# EAGLE design Green Pill Sparkfun (EAGLE 9.3.1)
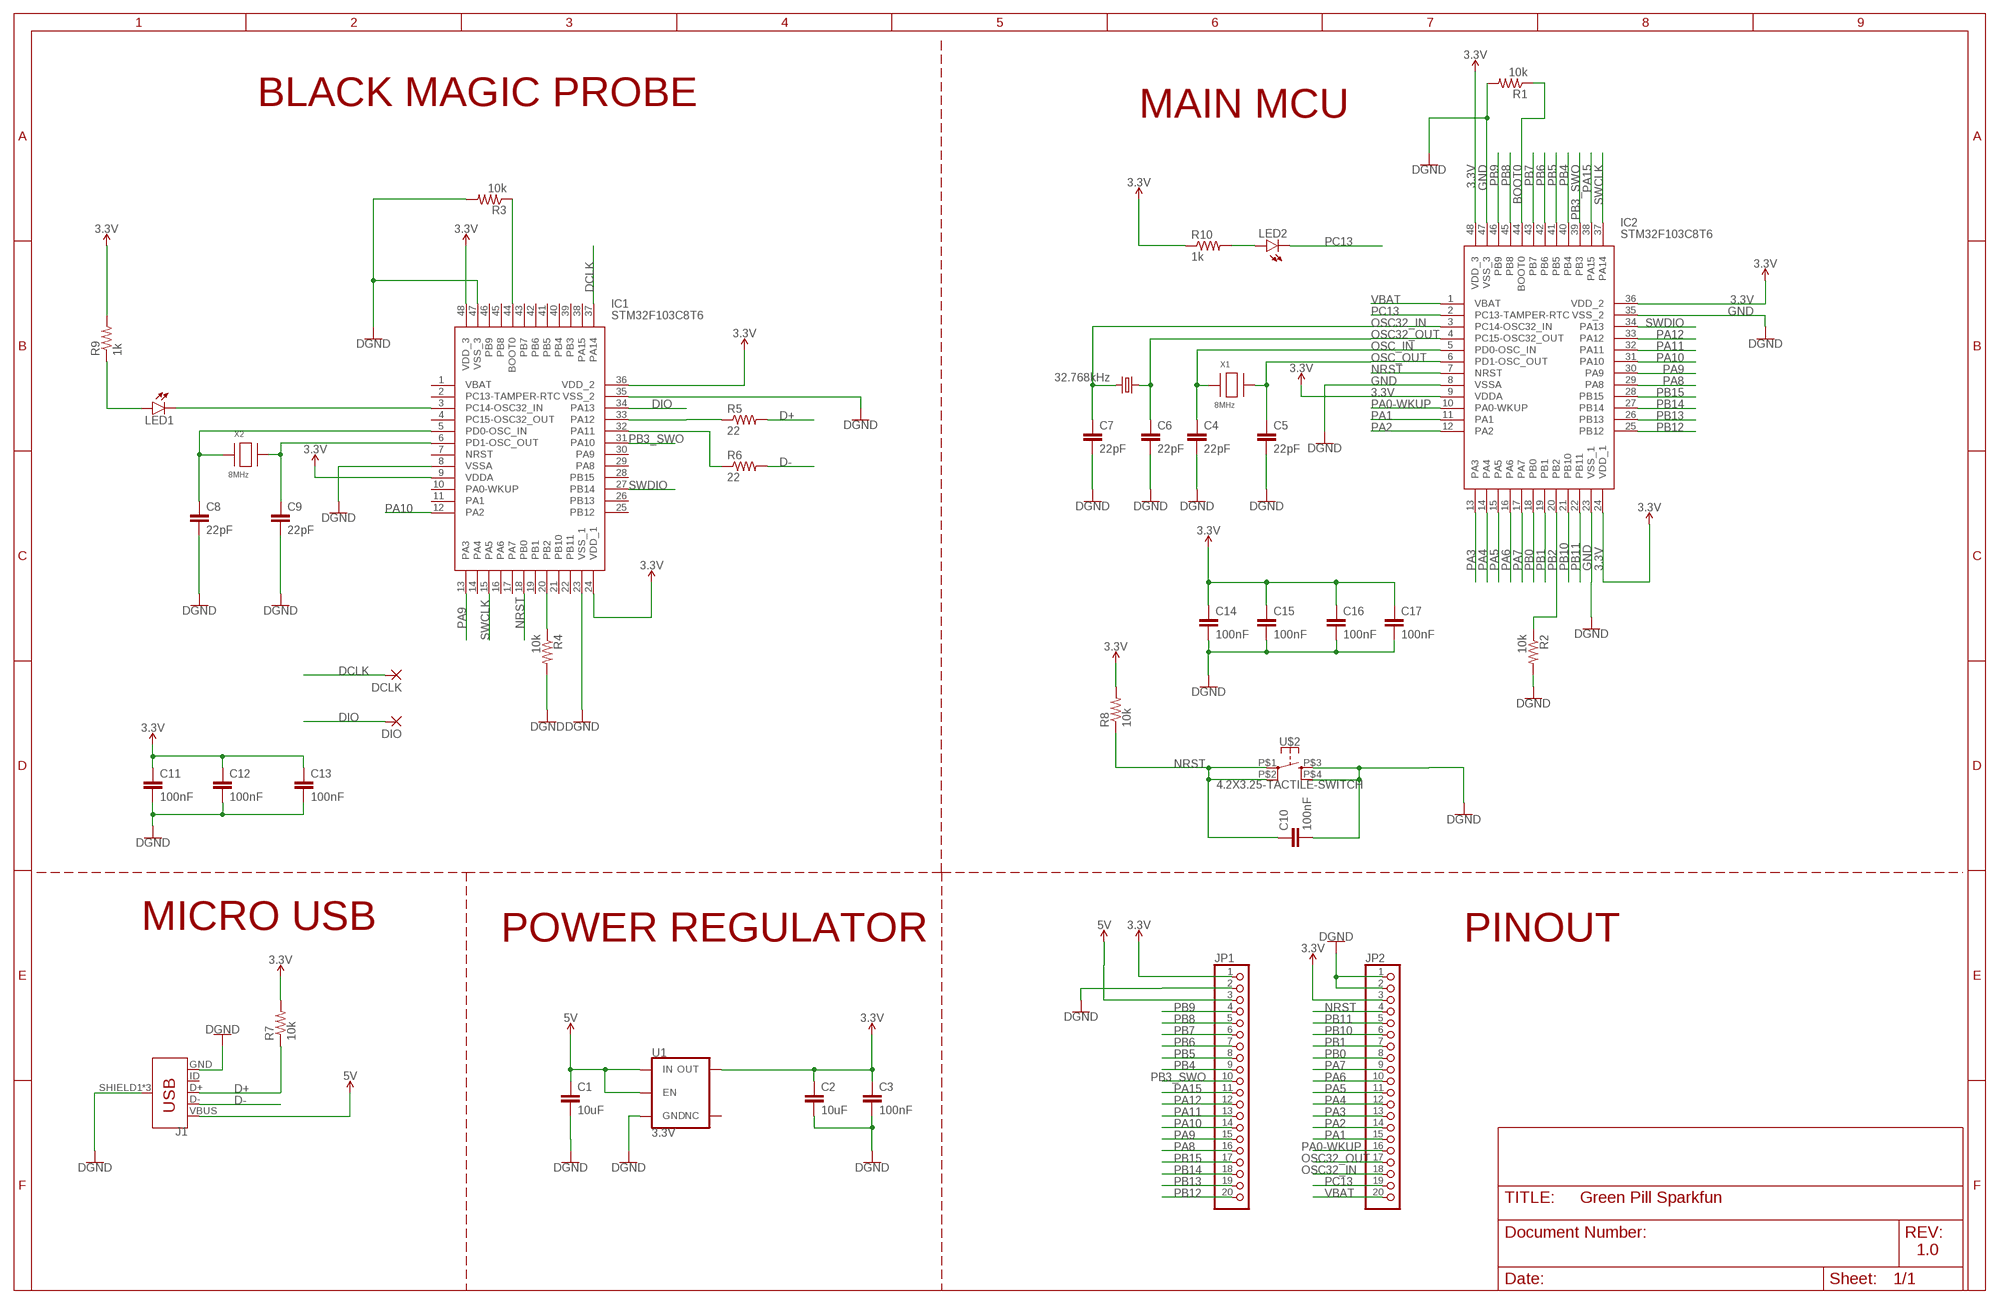
[diagram p0: schematic, sheet 1]

## Parts
C1  10uF  C-EUC0805  [C0805]
C2  10uF  C-EUC0805  [C0805]
C3  100nF  C-EUC0603  [C0603]
C4  22pF  C-EUC0603  [C0603]
C5  22pF  C-EUC0603  [C0603]
C6  22pF  C-EUC0603  [C0603]
C7  22pF  C-EUC0603  [C0603]
C8  22pF  C-EUC0603  [C0603]
C9  22pF  C-EUC0603  [C0603]
C10  100nF  C-EUC0603  [C0603]
C11  100nF  C-EUC0603  [C0603]
C12  100nF  C-EUC0603  [C0603]
C13  100nF  C-EUC0603  [C0603]
C14  100nF  C-EUC0603  [C0603]
C15  100nF  C-EUC0603  [C0603]
C16  100nF  C-EUC0603  [C0603]
C17  100nF  C-EUC0603  [C0603]
DCLK  SMD2  [SMD1,27-2,54]
DIO  SMD2  [SMD1,27-2,54]
IC1  STM32F103C8T6  [QFP50P900X900X160-48N]
IC2  STM32F103C8T6  [QFP50P900X900X160-48N]
J1  USB_MICRO-B_FEMALE-SMT  [USB-B-MICRO-SMD]
JP1  PINHD-1X20  [1X20]
JP2  PINHD-1X20  [1X20]
LED1  LEDCHIP-LED0805  [CHIP-LED0805]
LED2  LEDCHIP-LED0805  [CHIP-LED0805]
R1  10k  R-US_R0603  [R0603]
R2  10k  R-US_R0603  [R0603]
R3  10k  R-US_R0603  [R0603]
R4  10k  R-US_R0603  [R0603]
R5  22  R-US_R0603  [R0603]
R6  22  R-US_R0603  [R0603]
R7  10k  R-US_R0603  [R0603]
R8  10k  R-US_R0603  [R0603]
R9  1k  R-US_R0603  [R0603]
R10  1k  R-US_R0603  [R0603]
U1  3.3V  V_REG_AP2112K-3.3V  [SOT23-5]
U$1  32.768kHz  KX-327  [3.2X1.5]
U$2  4.2X3.25-TACTILE-SWITCH  [4.2X3.25]
X1  8MHz  XTALNX5032  [NX5032]
X2  8MHz  XTALNX5032  [NX5032]

## Nets
3.3V: C2.1 C3.1 C11.1 C12.1 C13.1 C14.1 C15.1 C16.1 C17.1 IC1.9(VDDA) IC1.24(VDD_1) IC1.36(VDD_2) IC1.48(VDD_3) IC2.9(VDDA) IC2.24(VDD_1) IC2.36(VDD_2) IC2.48(VDD_3) JP1.1 JP2.3 R7.2 R8.2 R9.2 R10.1 U1.5(OUT)
5V: C1.1 J1.VBUS JP1.3 U1.1(IN) U1.3(EN)
BOOT0: IC2.44(BOOT0) R1.1
D+: J1.D+ R5.2 R7.1
D-: J1.D- R6.2
DCLK: DCLK.1(P) IC1.37(PA14)
DIO: DIO.1(P) IC1.34(PA13)
GND: C1.2 C2.2 C3.2 C4.2 C5.2 C6.2 C7.2 C8.2 C9.2 C10.2 C11.2 C12.2 C13.2 C14.2 C15.2 C16.2 C17.2 IC1.8(VSSA) IC1.23(VSS_1) IC1.35(VSS_2) IC1.47(VSS_3) IC2.8(VSSA) IC2.23(VSS_1) IC2.35(VSS_2) IC2.47(VSS_3) J1.GND J1.SHIELD1(SHIELD) J1.SHIELD2(SHIELD) J1.SHIELD3(SHIELD) JP1.2 JP2.1 JP2.2 R1.2 R2.2 R3.2 R4.2 U1.2(GND) U$2.P$3 U$2.P$4 ; supply symbol labelled DGND
N$1: IC1.33(PA12) R5.1
N$2: IC1.32(PA11) R6.1
N$3: IC1.44(BOOT0) R3.1
N$4: C8.1 IC1.5(PD0-OSC_IN) X2.P$1
N$5: IC1.20(PB2) R4.1
N$6: C9.1 IC1.6(PD1-OSC_OUT) X2.P$2
N$7: IC1.3(PC14-OSC32_IN) LED1.C
N$8: LED1.A R9.1
N$9: LED2.A R10.2
NRST: C10.1 IC1.18(PB0) IC2.7(NRST) JP2.4 R8.1 U$2.P$1 U$2.P$2
OSC32_IN: C7.1 IC2.3(PC14-OSC32_IN) JP2.18 U$1.2
OSC32_OUT: C6.1 IC2.4(PC15-OSC32_OUT) JP2.17 U$1.1
OSC_IN: C4.1 IC2.5(PD0-OSC_IN) X1.P$1
OSC_OUT: C5.1 IC2.6(PD1-OSC_OUT) X1.P$2
PA0-WKUP: IC2.10(PA0-WKUP) JP2.16
PA1: IC2.11(PA1) JP2.15
PA2: IC2.12(PA2) JP2.14
PA3: IC2.13(PA3) JP2.13
PA4: IC2.14(PA4) JP2.12
PA5: IC2.15(PA5) JP2.11
PA6: IC2.16(PA6) JP2.10
PA7: IC2.17(PA7) JP2.9
PA8: IC2.29(PA8) JP1.16
PA9: IC1.13(PA3) IC2.30(PA9) JP1.15
PA10: IC1.12(PA2) IC2.31(PA10) JP1.14
PA11: IC2.32(PA11) JP1.13
PA12: IC2.33(PA12) JP1.12
PA15: IC2.38(PA15) JP1.11
PB0: IC2.18(PB0) JP2.8
PB1: IC2.19(PB1) JP2.7
PB2: IC2.20(PB2) R2.1
PB3_SWO: IC1.31(PA10) IC2.39(PB3) JP1.10
PB4: IC2.40(PB4) JP1.9
PB5: IC2.41(PB5) JP1.8
PB6: IC2.42(PB6) JP1.7
PB7: IC2.43(PB7) JP1.6
PB8: IC2.45(PB8) JP1.5
PB9: IC2.46(PB9) JP1.4
PB10: IC2.21(PB10) JP2.6
PB11: IC2.22(PB11) JP2.5
PB12: IC2.25(PB12) JP1.20
PB13: IC2.26(PB13) JP1.19
PB14: IC2.27(PB14) JP1.18
PB15: IC2.28(PB15) JP1.17
PC13: IC2.2(PC13-TAMPER-RTC) JP2.19 LED2.C
SWCLK: IC1.15(PA5) IC2.37(PA14)
SWDIO: IC1.27(PB14) IC2.34(PA13)
VBAT: IC2.1(VBAT) JP2.20
Unconnected: IC1.1(VBAT) IC1.2(PC13-TAMPER-RTC) IC1.4(PC15-OSC32_OUT) IC1.7(NRST) IC1.10(PA0-WKUP) IC1.11(PA1) IC1.14(PA4) IC1.16(PA6) IC1.17(PA7) IC1.19(PB1) IC1.21(PB10) IC1.22(PB11) IC1.25(PB12) IC1.26(PB13) IC1.28(PB15) IC1.29(PA8) IC1.30(PA9) IC1.38(PA15) IC1.39(PB3) IC1.40(PB4) IC1.41(PB5) IC1.42(PB6) IC1.43(PB7) IC1.45(PB8) IC1.46(PB9) J1.ID U1.4(NC)

## Notes on the sheet
- BLACK MAGIC PROBE | MAIN MCU
- MICRO USB | POWER REGULATOR | PINOUT
- 1.0

## Library data of the parts
C1-C3 C10-C17 = rcl:C-EU: CAPACITOR, European symbol; SPICEPREFIX: C
C4-C9 = resistor:C-EU: CAPACITOR, European symbol
DCLK DIO = wirepad:SMD2: SMD PAD
IC1 IC2 = LCSC:STM32F103C8T6: STM32F103C8T6, 32 bit ARM Cortex M3 Microcontroller 72MHz 64kb Flash, 20kb RAM, USB I2C SPI 48-Pin LQFP Source: Datasheet <http://www.mouser.com/datasheet/2/389/stm32f103c8-956229.pdf>; DESCRIPTION: STM32F103C8T6, 32 bit ARM Cortex M3 Microcontroller 72MHz 64kb Flash, 20kb RAM, USB I2C SPI 48-Pin LQFP; HEIGHT: 1.6mm; MANUFACTURER_NAME: STMicroelectronics; MANUFACTURER_PART_NUMBER: STM32F103C8T6; MOUSER_PART_NUMBER: 511-STM32F103C8T6
J1 = SparkFun-Connectors:USB_MICRO-B: USB Type Micro-B Connector Male/female and PTH/SMT variants SparkFun Products: SparkFun microB USB Breakout <https://www.sparkfun.com/products/12035> SparkFun USB microB Plug Breakout <https://www.sparkfun.com/products/10031> SparkFun ESP8266 Thing <https://www.sparkfun.com/products/13231>; PROD_ID: CONN-11752
JP1 JP2 = pinhead:PINHD-1X20: PIN HEADER
LED1 LED2 = led:LED: LED OSRAM: - CHIPLED LG R971, LG N971, LY N971, LG Q971, LY Q971, LO R971, LY R971 LH N974, LH R974 LS Q976, LO Q976, LY Q976 LO Q996 - Hyper CHIPLED LW Q18S LB Q993, LB Q99A, LB R99A - SideLED LS A670, LO A670, LY A670, LG A670, LP A670 LB A673, LV A673, LT A673, LW A673 LH A674 LY A675 LS A676, LA A676, LO A676, LY A676, LW A676 LS A679, LY A679, LG A679 - Hyper Micro SIDELED® LS Y876, LA Y876, LO Y876, LY Y876 LT Y87S - SmartLED LW L88C, LW L88S LB L89C, LB L89S, LG L890 LS L89K, LO L89K, LY L89K LS L896, LA L896, LO L896, LY L896 - TOPLED LS T670, LO T670, LY T670, LG T670, LP T670 LSG T670, LSP T670, LSY T670, LOP T670, LYG T670 LG T671, LOG T671, LSG T671 LB T673, LV T673, LT T673, LW T673 LH T674 LS T676, LA T676, LO T676, LY T676, LB T676, LH T676, LSB T676, LW T676 LB T67C, LV T67C, LT T67C, LS T67K, LO T67K, LY T67K, LW E67C LS E67B, LA E67B, LO E67B, LY E67B, LB E67C, LV E67C, LT E67C LW T67C LS T679, LY T679, LG T679 LS T770, LO T770, LY T770, LG T770, LP T770 LB T773, LV T773, LT T773, LW T773 LH T774 LS E675, LA E675, LY E675, LS T675 LS T776, LA T776, LO T776, LY T776, LB T776 LHGB T686 LT T68C, LB T68C - Hyper Mini TOPLED® LB M676 - Mini TOPLED Santana® LG M470 LS M47K, LO M47K, LY M47K Source: http://www.osram.convergy.de LUXEON: - LUMILED® LXK2-PW12-R00, LXK2-PW12-S00, LXK2-PW14-U00, LXK2-PW14-V00 LXK2-PM12-R00, LXK2-PM12-S00, LXK2-PM14-U00 LXK2-PE12-Q00, LXK2-PE12-R00, LXK2-PE12-S00, LXK2-PE14-T00, LXK2-PE14-U00 LXK2-PB12-K00, LXK2-PB12-L00, LXK2-PB12-M00, LXK2-PB14-N00, LXK2-PB14-P00, LXK2-PB14-Q00 LXK2-PR12-L00, LXK2-PR12-M00, LXK2-PR14-Q00, LXK2-PR14-R00 LXK2-PD12-Q00, LXK2-PD12-R00, LXK2-PD12-S00 LXK2-PH12-R00, LXK2-PH12-S00 LXK2-PL12-P00, LXK2-PL12-Q00, LXK2-PL12-R00 Source: www.luxeon.com KINGBRIGHT: KA-3528ASYC Source: www.kingbright.com
R1-R4 R8-R10 = rcl:R-US_: RESISTOR, American symbol; SPICEPREFIX: R
R5-R7 = resistor:R-US_: RESISTOR, American symbol
U1 = SparkFun-IC-Power:V_REG_AP2112: AP2112 - 600mA CMOS LDO Regulator w/ Enable The AP2112 is CMOS process low dropout linear regulator with enable function, the regulator delivers a guaranteed 600mA (min.) continuous load current. Features Output Voltage Accuracy: ±1.5% Output Current: 600mA (Min.) Foldback Short Current Protection: 50mA Enable Function to Turn ON/OFF VOUT Low Dropout Voltage (3.3V): 250mV (Typ.) @IOUT=600mA Excellent Load Regulation: 0.2%/A (Typ.) Excellent Line Regulation: 0.02%/V (Typ.) Low Quiescent Current: 55μA (Typ.) Low Standby Current: 0.01μA (Typ.) Low Output Noise: 50μVRMS PSRR: 100Hz -65dB, 1kHz -65dB OTSD Protection Stable with 1.0μF Flexible Cap: Ceramic, Tantalum and Aluminum Electrolytic Operation Temperature Range: -40°C to 85°C ESD: MM 400V, HBM 4000V; PROD_ID: VREG-12457
U$1 = SPEAR:KX-327
U$2 = LCSC:4.2X3.25-TACTILE-SWITCH
X1 X2 = adafruit:XTAL: Low cost SMT crystals, no capacitors included http://www.ladyada.net/library/eagle

## Board
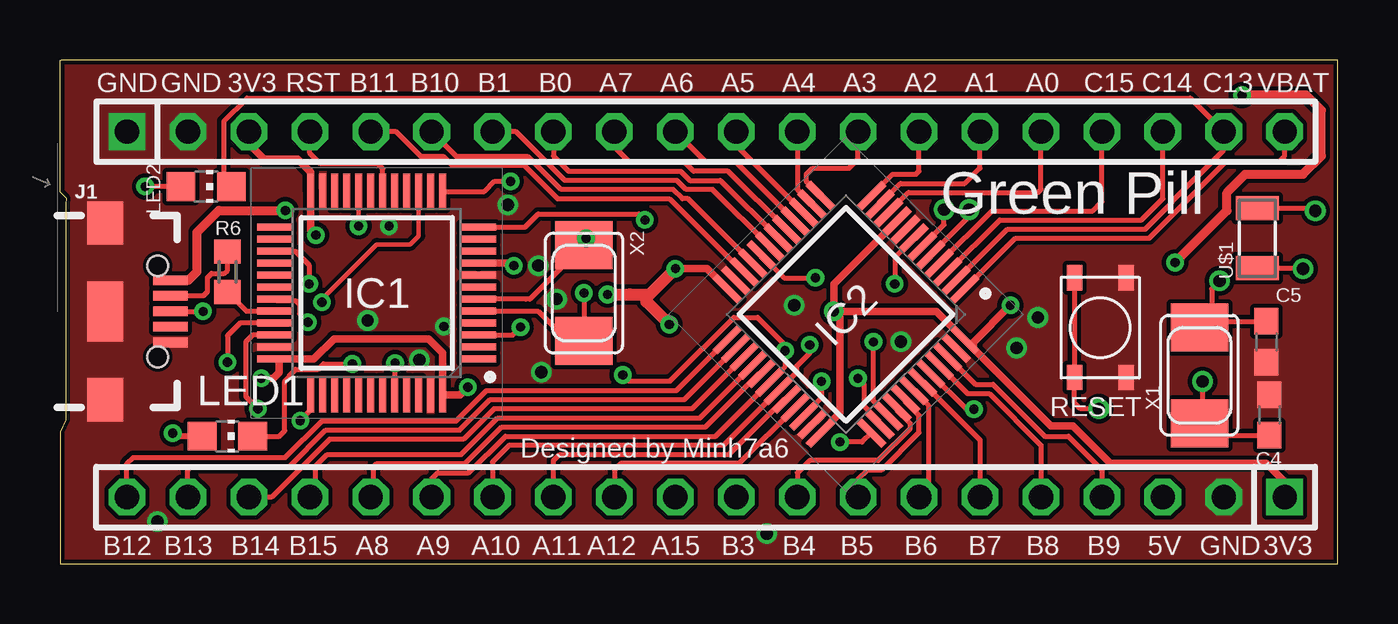
[diagram p1: board, top side]
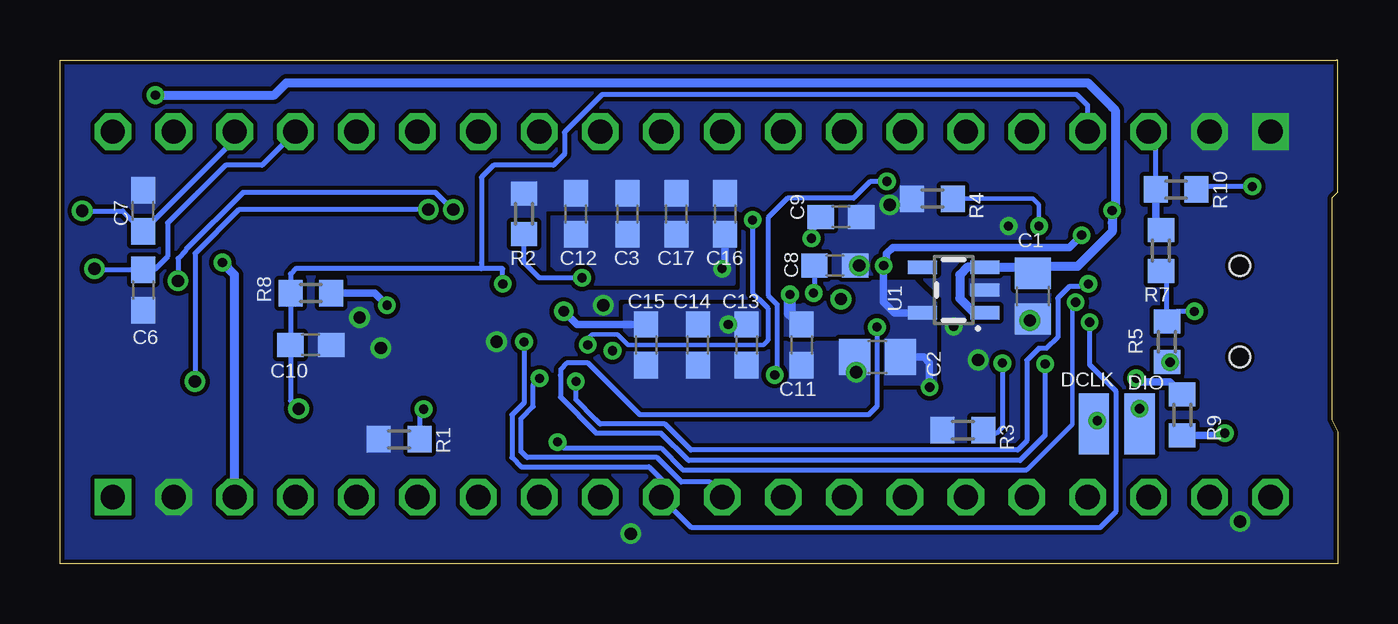
[diagram p2: board, bottom side, seen from below]

Size 53.25 x 21 mm. Coordinates in mm from the lower left corner, seen from the top.
Outline: 0.05,0 53.25,0 53.25,21 0.05,21 0,21 0,15.5 0.25,15.25 0.25,15 0.25,6 0,5.5 0,0 0.05,0
Copper layers (1*16): Top 0.035mm / dielectric 1.5mm / Bottom 0.035mm
Design rules "SparkFun-2-layer-TIGHT": minimum track width 7mil, minimum drill 15mil, track to track 7mil, track to pad 7mil, pad to pad 7mil, via to via 7mil, smd to smd 7mil, copper to edge 7mil, drill to drill 7mil, minimum pad ring 7mil, minimum via ring 7mil, stop-mask expansion 4mil, vias tented up to drill 25mil, thermal gap 10mil

### Footprints (pad centres in the part's own frame; a part is rotated, then mirrored left to right if it is on the bottom)
C0805 = smd 1.3 x 1.5: 1 -0.95,0; 2 0.95,0
C0603 = smd 1.1 x 1: 1 -0.85,0; 2 0.85,0
SMD1,27-2,54 = smd 1.27 x 2.54: 1 0,0
QFP50P900X900X160-48N = smd 1.475 x 0.3: 1 -4.238,2.75; 2 -4.238,2.25; 3 -4.238,1.75; 4 -4.238,1.25; 5 -4.238,0.75; 6 -4.238,0.25; 7 -4.238,-0.25; 8 -4.238,-0.75; 9 -4.238,-1.25; 10 -4.238,-1.75; 11 -4.238,-2.25; 12 -4.238,-2.75; 25 4.238,-2.75; 26 4.238,-2.25; 27 4.238,-1.75; 28 4.238,-1.25; 29 4.238,-0.75; 30 4.238,-0.25; 31 4.238,0.25; 32 4.238,0.75; 33 4.238,1.25; 34 4.238,1.75; 35 4.238,2.25; 36 4.238,2.75 | smd 0.3 x 1.475: 13 -2.75,-4.238; 14 -2.25,-4.238; 15 -1.75,-4.238; 16 -1.25,-4.238; 17 -0.75,-4.238; 18 -0.25,-4.238; 19 0.25,-4.238; 20 0.75,-4.238; 21 1.25,-4.238; 22 1.75,-4.238; 23 2.25,-4.238; 24 2.75,-4.238; 37 2.75,4.238; 38 2.25,4.238; 39 1.75,4.238; 40 1.25,4.238; 41 0.75,4.238; 42 0.25,4.238; 43 -0.25,4.238; 44 -0.75,4.238; 45 -1.25,4.238; 46 -1.75,4.238; 47 -2.25,4.238; 48 -2.75,4.238
USB-B-MICRO-SMD = smd 1.45 x 0.4: D+ 2.725,0; D- 2.725,0.65; GND 2.725,-1.3; ID 2.725,-0.65; VBUS 2.725,1.3 | smd 1.5 x 1.8: SHIELD1 0,3.685; SHIELD2 0,-3.685 | smd 1.5 x 2.5: SHIELD3 0,0 | hole 0.85: 2.2,1.9; 2.2,-1.9
1X20 = drill 1.016 square: 1 -24.13,0 | drill 1.016 octagon: 2 -21.59,0; 3 -19.05,0; 4 -16.51,0; 5 -13.97,0; 6 -11.43,0; 7 -8.89,0; 8 -6.35,0; 9 -3.81,0; 10 -1.27,0; 11 1.27,0; 12 3.81,0; 13 6.35,0; 14 8.89,0; 15 11.43,0; 16 13.97,0; 17 16.51,0; 18 19.05,0; 19 21.59,0; 20 24.13,0
CHIP-LED0805 = smd 1.2 x 1.2: A 0,-1.05; C 0,1.05
R0603 = smd 1 x 1.1: 1 -0.85,0; 2 0.85,0
SOT23-5 = smd 0.55 x 1.2: 1 -0.95,-1.3; 2 0,-1.3; 3 0.95,-1.3; 4 0.95,1.3; 5 -0.95,1.3
3.2X1.5 = smd 1 x 1.8: 1 -1.25,0; 2 1.25,0
4.2X3.25 = smd 1.05 x 0.65: P$1 0,0; P$2 4.15,0; P$3 4.15,2.15; P$4 0,2.15
NX5032 = smd 2 x 2.4: P$1 2,0; P$2 -2,0

### Placement (x,y rotation side)
C1  12.7,11.15 270 bottom
C2  19.17,8.61 180 bottom
C3  29.59,14.58 90 bottom
C4  50.41,6.2 90 top
C5  50.29,9.25 270 top
C6  49.78,11.41 270 bottom
C7  49.78,14.71 90 bottom
C8  20.95,12.42 0 bottom
C9  20.7,14.45 0 bottom
C10  42.8,9.12 0 bottom
C11  22.35,9.12 270 bottom
C12  31.75,14.58 90 bottom
C13  24.63,9.12 270 bottom
C14  26.67,9.12 270 bottom
C15  28.82,9.12 270 bottom
C16  25.52,14.58 90 bottom
C17  27.55,14.58 90 bottom
DCLK  10.16,5.82 0 bottom
DIO  8.25,5.82 0 bottom
IC1  13.2,11.28 180 top
IC2  32.76,10.39 225 top
J1  1.88,10.52 0 top
JP1  26.92,2.77 180 top
JP2  26.92,18.01 0 top
LED1  6.98,5.31 270 top
LED2  6.09,15.72 270 top
R1  39.11,5.18 180 bottom
R2  33.91,14.58 90 bottom
R3  15.62,5.56 180 bottom
R4  16.89,15.22 180 bottom
R5  7.11,9.25 90 bottom
R6  6.98,12.17 90 top
R7  7.36,13.06 90 bottom
R8  42.8,11.28 0 bottom
R9  6.47,6.2 90 bottom
R10  6.73,15.6 0 bottom
U1  16,11.41 90 bottom
U$1  49.91,13.56 90 top
U$2  42.29,11.91 270 top
X1  47.49,7.85 270 top
X2  21.84,11.28 270 top

### Tracks (layer width: path | path; a pad name or v marks a point on that pad's centre or on a via)
3.3V  (via drill 0.38, 0.45)
  Top 0.305: IC2.24 26.97,12.29 v25.65,12.29 | 38.07,8.97 IC2.48 36.52,10.52 v32.25,10.52 | 38.07,8.97 41.3,5.74 42.21,5.74 43.79,4.17 50.29,4.17 51.05,3.41 JP1.1 | IC2.9 32.25,11.65 v32.25,10.52 | IC2.36 31.71,5.48 32.51,6.28 32.51,10.26 v32.25,10.52 | JP2.3 7.87,17.5 8.51,16.87 9.9,16.87 10.45,16.31 IC1.24 10.45,13.9 v10.66,13.69 | v17,7.36 16.69,7.04 IC1.48 15.95,8.78 15.36,9.37 11.43,9.37 10.58,8.53 9.14,8.53 | v39.62,10.77 38.07,9.22 38.07,8.97 | IC1.36 9.14,8.53 | v8.39,7.72 8.89,7.72 9.14,7.98 9.14,8.53 | v18.92,12.42 18.81,12.53 IC1.9
  Top 0.508: v22.83,11.22 23.75,11.22 24.58,11.22 | 24.58,11.22 24.45,11.1 24.44,11.09 24.44,10.92 v25.4,9.97 | 24.58,11.22 v25.65,12.29
  Bottom 0.203: R10.1 7.58,15.85 7.58,17.72 JP2.3
  Bottom 0.305: v25.65,12.29 25.52,12.42 C16.1 | v32.25,10.52 31.71,9.97 C15.1 | v10.66,13.69 11.17,13.18 18.54,13.18 18.79,12.93 18.79,12.55 v18.92,12.42 18.92,10.9 | U1.5 18.48,10.46 18.66,10.64 | 18.92,10.9 18.86,10.84 | 18.86,10.84 18.66,10.64 | R7.2 7.58,14.12 7.58,15.85 | v17,7.36 17,8.37 17.24,8.61 C2.1 | R8.2 40.13,11.28 v39.62,10.77 | R9.2 6.99,7.57 8.23,7.57 v8.39,7.72 | 18.79,10.77 18.66,10.64 | 18.92,10.9 18.86,10.84
  Bottom 0.508: C11.1 22.83,10.45 v22.83,11.22
  pour Bottom (no thermals): 25.14,14.45 32.76,14.45 32.76,12.42 32,11.66 25.14,11.66
  pour Bottom (no thermals): 16.76,10.9 16.76,7.47 19.05,7.47 19.05,8.74 19.81,9.5 29.71,9.5 29.71,10.77 22.35,10.77 21.33,11.79 17.65,11.79
5V  (via drill 0.38)
  Top 0.381: J1.VBUS 5.36,11.82 5.71,12.17 5.71,13.82 6.62,14.72 v9.39,14.72 | v46.48,12.55 48.64,14.71 48.64,15.47 49.4,16.23 51.81,16.23 52.57,16.99 52.57,18.9 51.94,19.53 v49.27,19.53
  Bottom 0.381: 12.73,12.13 12.95,12.36 U1.3 15.43,12.36 15.74,12.04 15.74,11.06 15.14,10.46 U1.1 | 12.73,12.13 12.98,12.39 10.84,12.39 9.39,13.84 9.39,14.2 | 12.73,12.13 C1.1 | v9.39,14.72 9.39,14.2 | 9.39,14.2 9.39,14.84 9.27,14.96 9.27,18.9 9.39,19.03 10.41,20.04 43.81,20.04 44.32,19.53 v49.27,19.53 | JP1.3 45.97,12.04 v46.48,12.55
BOOT0  (via drill 0.38)
  Top 0.203: IC2.44 37.77,6.44 v38.1,6.44
  Bottom 0.203: v38.1,6.44 38.26,6.27 R1.1
D+  (via drill 0.38)
  Top 0.203: J1.D+ v5.96,10.52 v5.96,10.51
  Bottom 0.203: v5.96,10.51 6.69,10.51 R5.2 7.11,11.95 R7.1
D-
  Top 0.203: J1.D- 5.98,11.17 6.15,11.34 6.15,11.93 6.32,12.1 6.85,12.1 6.98,12.22 R6.2
DCLK  (via drill 0.38)
  Top 0.203: IC1.37 10.45,6.4 v10.02,5.96
  Bottom 0.203: DCLK.1 v10.02,5.96
DIO  (via drill 0.38)
  Top 0.203: IC1.34 8.03,9.53 7.74,9.25 7.74,6.96 v8.25,6.46
  Bottom 0.203: v8.25,6.46 DIO.1
GND  (via drill 0.38, 0.51)
  other vias: 12.82,10.14 14.98,8.48 19.93,12.42 35.05,9.25 18.66,14.96 13.71,14.07 29.46,1.25 4.06,1.75 30.6,10.77 20.7,11.03 20.06,7.98 16,9.88 40.76,10.26 39.87,8.99
  pour Bottom (rank 6, no thermals): -0.13,23.09 -0.13,-0.91 53.72,-0.91 53.72,23.09
  pour Top (rank 6, no thermals): -0.13,22.33 -0.13,-1.29 54.1,-1.29 54.1,22.33
N$1  (via drill 0.38)
  Top 0.203: IC1.33 7.51,10.03 6.98,9.5 v6.98,8.4
  Bottom 0.305: R5.1 v6.98,8.4
N$2
  Top 0.203: R6.1 7.77,10.53 IC1.32
N$3  (via drill 0.38)
  Top 0.203: IC1.44 13.97,7.05 v13.97,8.36
  Bottom 0.203: v13.97,8.36 13.97,5.69 14.22,5.44 14.64,5.44 R3.1
N$4  (via drill 0.38)
  Top 0.203: IC1.5 19.92,10.53 21.17,9.28 X2.P$1 v21.84,11.28
  Bottom 0.203: C8.1 21.8,11.32 v21.84,11.28
N$5  (via drill 0.38)
  Top 0.178: IC1.20 12.45,14.09 v12.44,14.07
  Bottom 0.178: v12.44,14.07 12.44,14.96 12.7,15.22 16,15.22 16.02,15.2
  Bottom 0.203: 16.02,15.2 R4.1
N$6  (via drill 0.38)
  Top 0.203: IC1.6 19.43,11.03 19.59,11.03 X2.P$2 21.84,13.48 v21.93,13.56
  Bottom 0.203: C9.1 21.44,14.35 21.93,13.86 v21.93,13.56
N$7  (via drill 0.38)
  Top 0.203: IC1.3 18.87,9.53 v19.2,9.86 | v12.19,8.32 10.99,8.32 10.76,8.1 9.82,8.1 9.57,7.85 9.57,7.8 9.37,7.59 9.37,5.54 9.14,5.31 LED1.C
  Bottom 0.203: v19.2,9.86 19.2,9.48 19.19,9.48 19.19,6.56 19.55,6.2 29.08,6.2 31.24,8.36 32.13,8.36 32.38,8.1 32.38,7.88 32.39,7.86 32.39,6.94 30.89,5.44 28.19,5.44 27.05,4.29 13.23,4.29 12.19,5.34 v12.19,8.32
N$8  (via drill 0.38)
  Top 0.254: LED1.A 4.82,5.31 v4.7,5.44
  Bottom 0.305: v4.7,5.44 4.78,5.35 R9.1
N$9  (via drill 0.38)
  Top 0.203: LED2.A v3.55,15.72
  Bottom 0.203: v3.55,15.72 5.75,15.72 R10.2
NRST  (via drill 0.38, 0.51)
  Top 0.203: v43.3,6.45 42.54,6.45 42.29,6.71 U$2.P$2 U$2.P$1 | IC2.7 34.79,12.78 v34.79,11.66 | IC1.18 13.45,16.46 13.25,16.66 10.87,16.66 10.41,17.12 JP2.4
  Bottom 0.203: v43.3,6.45 43.65,6.79 C10.1 R8.1 43.65,12.08 43.43,12.29 35.68,12.29 | v34.79,11.66 34.79,12.29 35.68,12.29 | 35.68,12.29 35.68,12.55 35.68,16.11 35.17,16.61 32.69,16.61 32.23,17.07 32.23,17.98 30.65,19.56 10.87,19.56 10.41,19.1 JP2.4
OSC32_IN  (via drill 0.51)
  Top 0.203: IC2.3 39.17,14.33 45.08,14.33 45.97,15.22 JP2.18 | U$1.2 52.21,14.81 v52.32,14.71
  Bottom 0.203: JP2.18 45.97,17.67 C7.1 50.63,14.71 v52.32,14.71
OSC32_OUT  (via drill 0.51)
  Top 0.203: IC2.4 38.85,14.71 43.05,14.71 43.43,15.09 JP2.17 | U$1.1 51.79,12.31 v51.81,12.29
  Bottom 0.203: JP2.17 44.83,16.61 46.35,16.61 48.76,14.2 48.76,12.8 49.31,12.26 C6.1 51.77,12.26 v51.81,12.29
OSC_IN  (via drill 0.51)
  Top 0.203: IC2.5 37.89,14.46 v37.89,14.76 | v47.62,7.6 47.62,5.98 X1.P$1 47.99,5.35 C4.1
  Bottom 0.203: v37.89,14.76 45.79,14.76 47.62,12.93 v47.62,7.6
OSC_OUT  (via drill 0.51)
  Top 0.203: X1.P$2 47.74,10.1 48,10.1 | 48,10.1 C5.1 | IC2.6 36.85,14.13 v36.85,14.76 | v48.33,11.79 48,11.46 48,10.1
  Bottom 0.203: v36.85,14.76 36.89,14.76 37.6,15.47 45.62,15.47 48,13.09 48,13.06 48.33,12.73 v48.33,11.79
PA0-WKUP
  Top 0.203: IC2.10 35.37,15.47 40.76,15.47 40.89,15.6 JP2.16
PA1
  Top 0.203: IC2.11 35.04,15.85 37.72,15.85 38.35,16.49 JP2.15
PA2
  Top 0.203: IC2.12 34.72,16.23 35.68,16.23 35.81,16.36 JP2.14
PA3
  Top 0.203: IC2.13 31.11,15.93 31.11,16.23 31.36,16.49 32.89,16.49 33.27,16.87 JP2.13
PA4
  Top 0.203: JP2.12 30.73,15.6 IC2.14
PA5
  Top 0.203: IC2.15 28.19,17.44 JP2.11
PA6
  Top 0.203: IC2.16 28.18,16.74 26.92,16.74 JP2.10
PA7
  Top 0.203: IC2.17 27.85,16.36 26.41,16.36 26.03,16.74 23.75,16.74 23.11,17.38 JP2.9
PA8
  Top 0.203: JP1.16 13.08,2.9 13.08,4.04 13.2,4.17 16.88,4.17 18.41,5.69 26.9,5.69 29.14,7.92 IC2.29
PA9  (via drill 0.38)
  Top 0.178: IC2.30 30.22,8.2 v30.22,8.87
  Top 0.203: JP1.15 15.49,3.53 15.74,3.79 17.04,3.79 18.57,5.31 27.33,5.31 IC2.30 | v23.46,7.86 23.71,7.61 25.43,7.61 28.08,10.26 29.08,10.26 30.22,9.12 v30.22,8.87 | IC1.13 17.7,15.52 18.12,15.94 v18.78,15.94
  Bottom 0.203: v18.78,15.94 19.46,15.94 20.17,15.23 22.93,15.23 23.73,14.43 23.73,11.18 23.36,10.81 23.36,7.96 v23.46,7.86
PA10  (via drill 0.38)
  Top 0.203: JP1.14 18.03,4.24 18.72,4.93 27.66,4.93 29.19,6.47 IC2.31 30.72,7.99 30.72,8.25 31.25,8.78 v31.25,9.12 | IC1.12 19.3,14.03 19.38,14.03 19.93,14.58 24.13,14.58 v24.38,14.33
  Bottom 0.178: 23.74,9.31 23.93,9.12 29.57,9.12 30,9.55 31.07,9.55 31.25,9.37
  Bottom 0.203: 23.74,9.31 23.74,10.65 24.12,11.03 24.38,11.29 v24.38,14.33 | 31.25,9.37 v31.25,9.12
PA11
  Top 0.203: JP1.13 20.57,4.29 20.82,4.55 27.88,4.55 29.56,6.23 30.2,6.86 IC2.32
PA12
  Top 0.203: IC2.33 28.31,4.17 23.36,4.17 23.11,3.91 JP1.12
PA15  (via drill 0.38)
  Top 0.203: IC2.38 34.17,5.9 33.52,6.55 33.52,7.46 v33.26,7.72
  Bottom 0.203: JP1.11 25.65,2.9 26.16,3.41 27.35,3.41 28.37,4.42 33.78,4.42 34.03,4.67 34.03,6.04 33.52,6.55 33.52,7.46 v33.26,7.72
PB0
  Top 0.203: JP2.8 20.57,16.99 21.2,16.36 25.87,16.36 26.25,15.98 27.53,15.98 IC2.18
PB1
  Top 0.203: IC2.19 27.2,15.6 26.1,15.6 25.71,15.98 21.05,15.98 19.02,18.01 JP2.7
PB2  (via drill 0.38)
  Top 0.203: IC2.20 30.18,11.91 v31.49,11.91
  Bottom 0.203: v31.49,11.91 33.27,11.91 33.91,12.55 R2.1
PB3_SWO  (via drill 0.38)
  Top 0.203: IC2.39 33.91,6.77 v33.91,9.25 | IC1.31 9.04,10.96 9.82,10.96 9.98,10.79 9.98,10.41 v10.34,10.06
  Bottom 0.203: v33.91,9.25 33.91,6.71 34.41,6.2 34.41,4.42 34.03,4.04 28.7,4.04 28.19,3.53 JP1.10 26.92,1.5 9.9,1.5 9.24,2.16 9.24,7.2 10.34,8.3 v10.34,10.06
PB4
  Top 0.203: IC2.40 34.88,6.41 35.43,5.86 35.43,5.62 34.1,4.29 31.24,4.29 30.73,3.79 JP1.9
PB5
  Top 0.203: JP1.8 33.27,3.53 33.65,3.91 34.26,3.91 35.81,5.47 35.81,6.18 35.23,6.76 IC2.41
PB6
  Top 0.203: IC2.42 36.19,6.61 36.19,3.15 JP1.7
PB7
  Top 0.203: IC2.43 38.35,5.16 JP1.6
PB8
  Top 0.203: IC2.45 37.83,7.09 38.73,7.09 40.89,4.93 JP1.5
PB9
  Top 0.203: IC2.46 38.16,7.47 38.89,7.47 41.05,5.31 42.03,5.31 43.43,3.91 JP1.4
PB10
  Top 0.203: IC2.21 26.17,15.22 25.94,15.22 25.56,15.6 20.89,15.6 19.52,16.97 16.53,16.97 JP2.6
PB11
  Top 0.203: IC2.22 28.46,12.15 25.4,15.22 20.73,15.22 19.36,16.59 16.37,16.59 15.99,16.97 15.06,16.97 14.02,18.01 JP2.5
PB12
  Top 0.203: JP1.20 2.79,4.17 3.04,4.42 9.39,4.42 10.92,5.95 16.51,5.95 17.78,7.21 25.7,7.21 IC2.25
PB13
  Top 0.203: JP1.19 5.33,3.91 5.46,4.04 9.55,4.04 11.08,5.56 16.66,5.56 17.93,6.83 26.02,6.83 IC2.26
PB14
  Top 0.203: IC2.27 26.35,6.45 18.09,6.45 16.82,5.18 13.33,5.18 11.23,5.18 8.82,2.77 JP1.18
PB15
  Top 0.203: JP1.17 10.66,3.02 10.66,4.08 11.14,4.55 16.73,4.55 18.25,6.07 26.68,6.07 IC2.28
PC13
  Top 0.203: IC2.2 39.5,13.95 45.24,13.95 46.35,15.06 46.35,15.09 48.51,17.25 48.51,17.88 | 48.51,17.88 JP2.19 | LED2.C 6.83,16.04 6.83,18.44 7.79,19.41 47.11,19.41 JP2.19 | JP2.19 48.51,17.88
SWCLK  (via drill 0.38)
  Top 0.178: IC1.15 14.95,13.66 14.6,13.31 13.2,13.31 10.92,11.03 v10.92,10.9
  Top 0.203: IC2.37 33.43,5.07 v32.51,5.07
  Bottom 0.178: 12.95,3.91 11.06,5.8 11.06,10.76 v10.92,10.9
  Bottom 0.203: v32.51,5.07 32.25,4.81 28.2,4.81 27.3,3.91 12.95,3.91
SWDIO  (via drill 0.38)
  Top 0.203: IC2.34 31.75,6.9 v31.75,7.6 | IC1.27 9.8,13.03 10.38,12.45 v10.38,11.66
  Bottom 0.203: v31.75,7.6 31.75,6.83 30.92,6.01 30.73,5.82 28.03,5.82 26.95,4.73 13.33,4.73 12.95,5.12 12.95,8.48 12.46,8.97 12.13,8.97 11.67,9.44 11.67,11.06 11.19,11.55 10.5,11.55 v10.38,11.66
VBAT
  Top 0.203: IC2.1 39.83,13.56 45.4,13.56 48.57,16.74 50.8,16.74 51.05,16.99 JP2.20

### Text on the board
tPlace: GND | GND | 3V3 | RST | B11 | B10 | B1 | B0 | A7 | A6 | A5 | A4 | A3 | A2 | A1 | A0 | C15 | C14 | C13 | VBAT | Green Pill | RESET | Designed by Minh7a6 | B12 | B13 | B14 | B15 | A8 | A9 | A10 | A11 | A12 | A15 | B3 | B4 | B5 | B6 | B7 | B8 | B9 | 5V | GND | 3V3